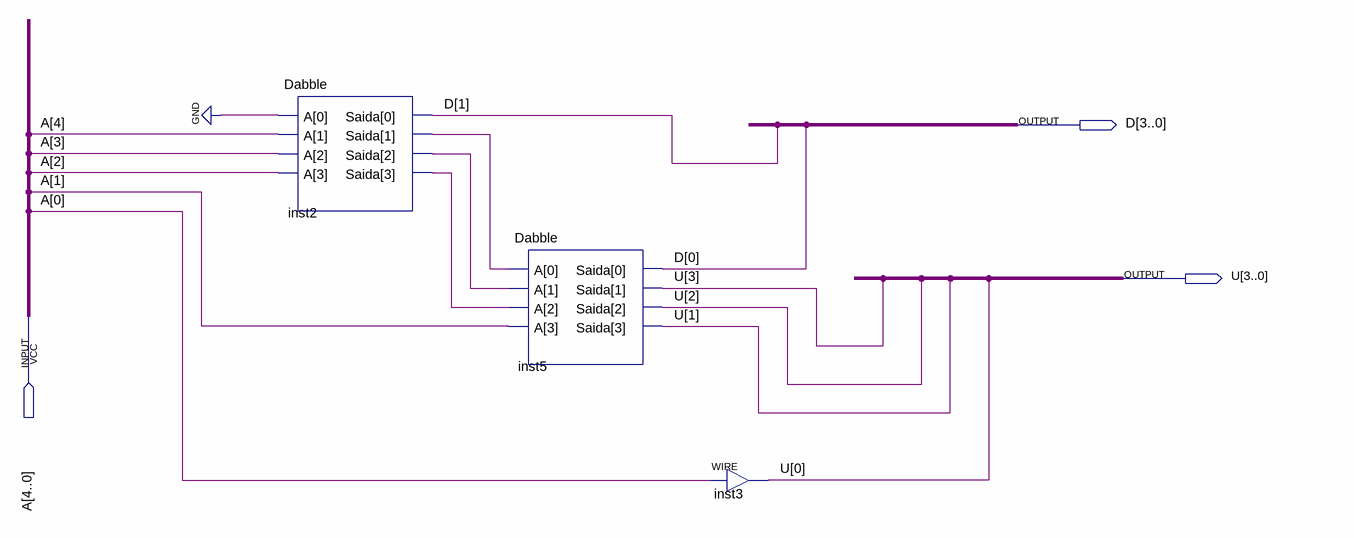
[diagram p0: schematic sheet]
// Quartus schematic Decoder.bdf as structural Verilog: 3 symbols, 3 pins
module Decoder (
  input  [4:0] A,
  output [3:0] D,
  output [3:0] U
);

  wire inst2_saida, inst2_saida_2, inst2_saida_3;

  Dabble inst2 (.A({A[2], A[3], A[4], 1'b0}), .Saida({inst2_saida_3, inst2_saida_2, inst2_saida, D[1]}));
  Dabble inst5 (.A({A[1], inst2_saida_3, inst2_saida_2, inst2_saida}), .Saida({U[1], U[2], U[3], D[0]}));
  assign U[0] = A[0];  // WIRE inst3
endmodule
